# EAGLE design LCD shield C144MVGD v1 (EAGLE 6.1)
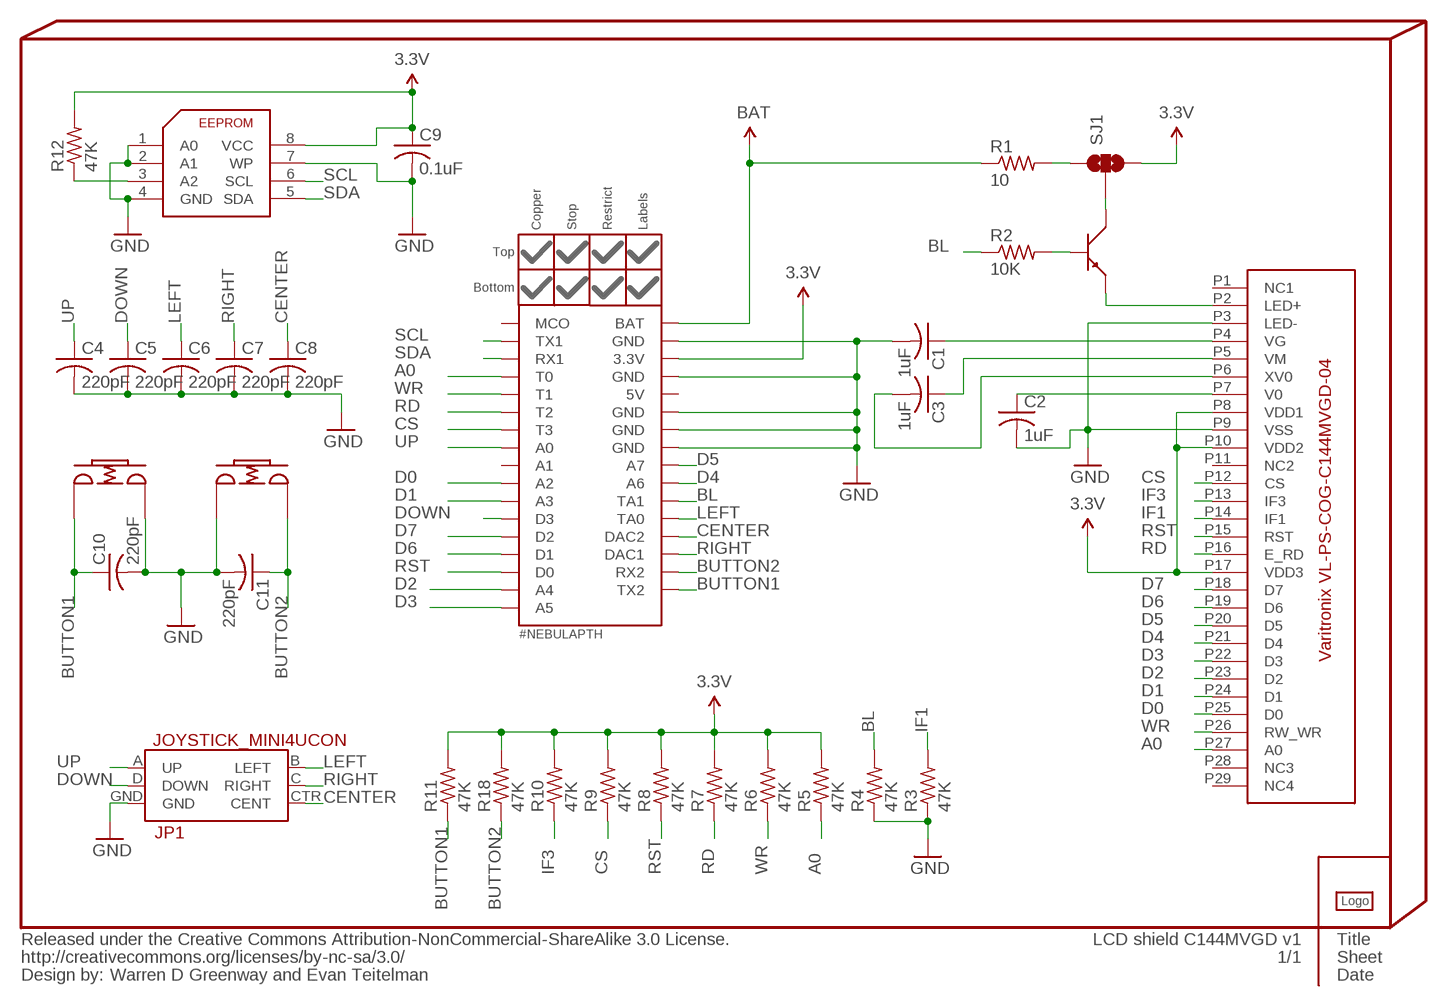
[diagram p0: schematic, sheet 1]

## Parts
C1  1uF  C-USC0402  [C0402]
C2  1uF  C-USC0402  [C0402]
C3  1uF  C-USC0402  [C0402]
C4  220pF  C-USC0402  [C0402]
C5  220pF  C-USC0402  [C0402]
C6  220pF  C-USC0402  [C0402]
C7  220pF  C-USC0402  [C0402]
C8  220pF  C-USC0402  [C0402]
C9  0.1uF  C-USC0402  [C0402]
C10  220pF  C-USC0402  [C0402]
C11  220pF  C-USC0402  [C0402]
INFO3  Warren D Greenway and Evan Teitelman  %CC-NC-SA  [%CC-NC-SA]
JP1  JOYSTICK_MINI4UCON  [JOYSTICK_MINI]
LOGO1  #PYGMYLOGOLARGE  [#PYGMYLOGO]
NEBULA1  #NEBULAPTH  [#NEBULA-PTH]
R1  10  R-US_R0805  [R0805]
R2  10K  R-US_R0402  [R0402]
R3  47K  R-US_R0402  [R0402]
R4  47K  R-US_R0402  [R0402]
R5  47K  R-US_R0402  [R0402]
R6  47K  R-US_R0402  [R0402]
R7  47K  R-US_R0402  [R0402]
R8  47K  R-US_R0402  [R0402]
R9  47K  R-US_R0402  [R0402]
R10  47K  R-US_R0402  [R0402]
R11  47K  R-US_R0402  [R0402]
R12  47K  R-US_R0402  [R0402]
R18  47K  R-US_R0402  [R0402]
SJ1  SOLDERJUMPER_2WAYPASTE1&2  [SJ_3_PASTE1&2]
U1  VARITRONIX_VL-PS-COG-C144MVGD-04FOLDED  [VARITRONIX_C144MVGD_FOLDED]
U2  BIPOLAR-PMBT6428  [DUBLIB_SOT23]
U3  EEPROM-ATMEL-AT24HC02B  [TSSOP8]
U4  SWITCH-ALPS-SKRG  [SWITCH-2P-5MM]
U5  SWITCH-ALPS-SKRG  [SWITCH-2P-5MM]

## Nets
3.3V: C9.1 NEBULA1.3.3V R5.2 R6.2 R7.2 R8.2 R9.2 R10.2 R11.2 R12.2 R18.2 SJ1.3 U1.P8(VDD1) U1.P10(VDD2) U1.P17(VDD3) U3.8(VCC) ; supply symbol labelled @3.3V
A0: NEBULA1.T0 R5.1 U1.P27(A0)
BAT: NEBULA1.BAT R1.1 ; supply symbol labelled @BAT
BL: NEBULA1.TA1 R2.1 R4.2
BUTTON1: C10.1 NEBULA1.COM2_TX(TX2) R11.1 U4.P1
BUTTON2: C11.1 NEBULA1.COM2_RX(RX2) R18.1 U5.P2
CENTER: C8.1 JP1.CTR(CENT) NEBULA1.DAC2
CS: NEBULA1.T3 R9.1 U1.P12(CS)
D0: NEBULA1.A2 U1.P25(D0)
D1: NEBULA1.A3 U1.P24(D1)
D2: NEBULA1.A4 U1.P23(D2)
D3: NEBULA1.A5 U1.P22(D3)
D4: NEBULA1.A6 U1.P21(D4)
D5: NEBULA1.A7 U1.P20(D5)
D6: NEBULA1.D1 U1.P19(D6)
D7: NEBULA1.D2 U1.P18(D7)
DOWN: C5.1 JP1.D(DOWN) NEBULA1.D3
GND: C1.2 C2.2 C4.2 C5.2 C6.2 C7.2 C8.2 C9.2 C10.2 C11.2 JP1.GND NEBULA1.GND1(GND) NEBULA1.GND2(GND) NEBULA1.GND3(GND) NEBULA1.GND4(GND) NEBULA1.GND5(GND) R3.1 R4.1 U1.P3(LED-) U1.P9(VSS) U3.1(A0) U3.2(A1) U3.4(GND) U3.7(WP) U4.P2 U5.P1 ; supply symbol labelled @GND
IF1: R3.2 U1.P14(IF1)
IF3: R10.1 U1.P13(IF3)
LEFT: C6.1 JP1.B(LEFT) NEBULA1.TA0
N$1: C1.1 U1.P4(VG)
N$2: C3.1 U1.P5(VM)
N$3: C3.2 U1.P6(XV0)
N$4: C2.1 U1.P7(V0)
N$5: SJ1.2 U2.3
N$6: U1.P2(LED+) U2.2
N$7: R2.2 U2.1
N$9: R1.2 SJ1.1
N$11: R12.1 U3.3(A2)
RD: NEBULA1.T2 R7.1 U1.P16(E_RD)
RIGHT: C7.1 JP1.C(RIGHT) NEBULA1.DAC1
RST: NEBULA1.D0 R8.1 U1.P15(RST)
SCL: NEBULA1.COM1_TX(TX1) U3.6(SCL)
SDA: NEBULA1.COM1_RX(RX1) U3.5(SDA)
UP: C4.1 JP1.A(UP) NEBULA1.A0
WR: NEBULA1.T1 R6.1 U1.P26(RW_WR)
Unconnected: NEBULA1.5V NEBULA1.A1 NEBULA1.MCO U1.P1(NC1) U1.P11(NC2) U1.P28(NC3) U1.P29(NC4)

## Library data of the parts
C1-C11 = rcl:C-US: CAPACITOR, American symbol
INFO3 = PygmyBoards:%CC-NC-SA: Released under the Creative Commons Attribution-NonCommercial-ShareAlike 3.0 License. http://creativecommons.org/licenses/by-sa/3.0 Design by: [Designer Name] Change this part's value to change the designer name
JP1 = SparkFun:JOYSTICK_MINI
LOGO1 = Pygmy:#PYGMYLOGO
NEBULA1 = PygmyBoards:#NEBULA: Nebula Board and Shield Footprint Pads This is the only absolutely required part for the footprint. The parts in "#NEBULA-PART" are merely aesthetic. A circular board outline should be .001" thick and 1.005" in diameter (Reference circle on the Document (48) layer provided).
R1-R12 R18 = rcl:R-US_: RESISTOR, American symbol
SJ1 = Pygmy:SOLDERJUMPER_2WAY: Solder Jumper 2 way solder jumper
U1 = Pygmy:VARITRONIX_VL-PS-COG-C144MVGD-04
U2 = Pygmy:BIPOLAR-PMBT6428
U3 = Pygmy:EEPROM-ATMEL-AT24HC02B
U4 U5 = Pygmy:SWITCH-ALPS-SKRG

## Board
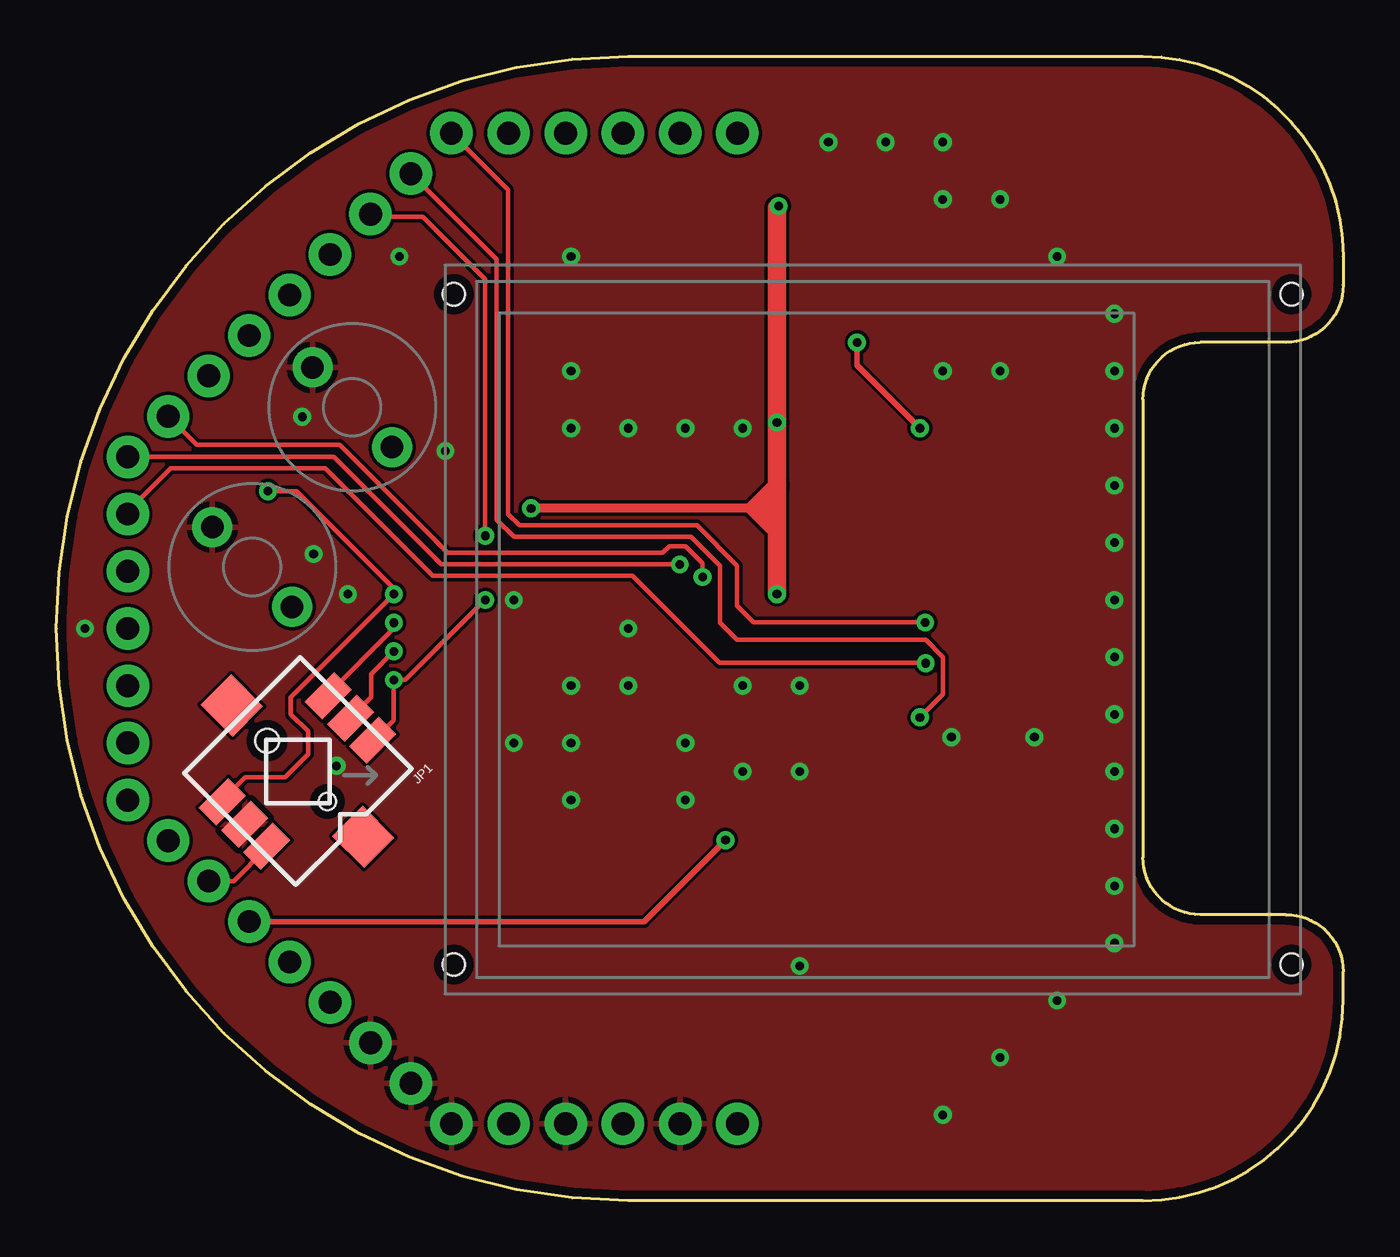
[diagram p1: board, top side]
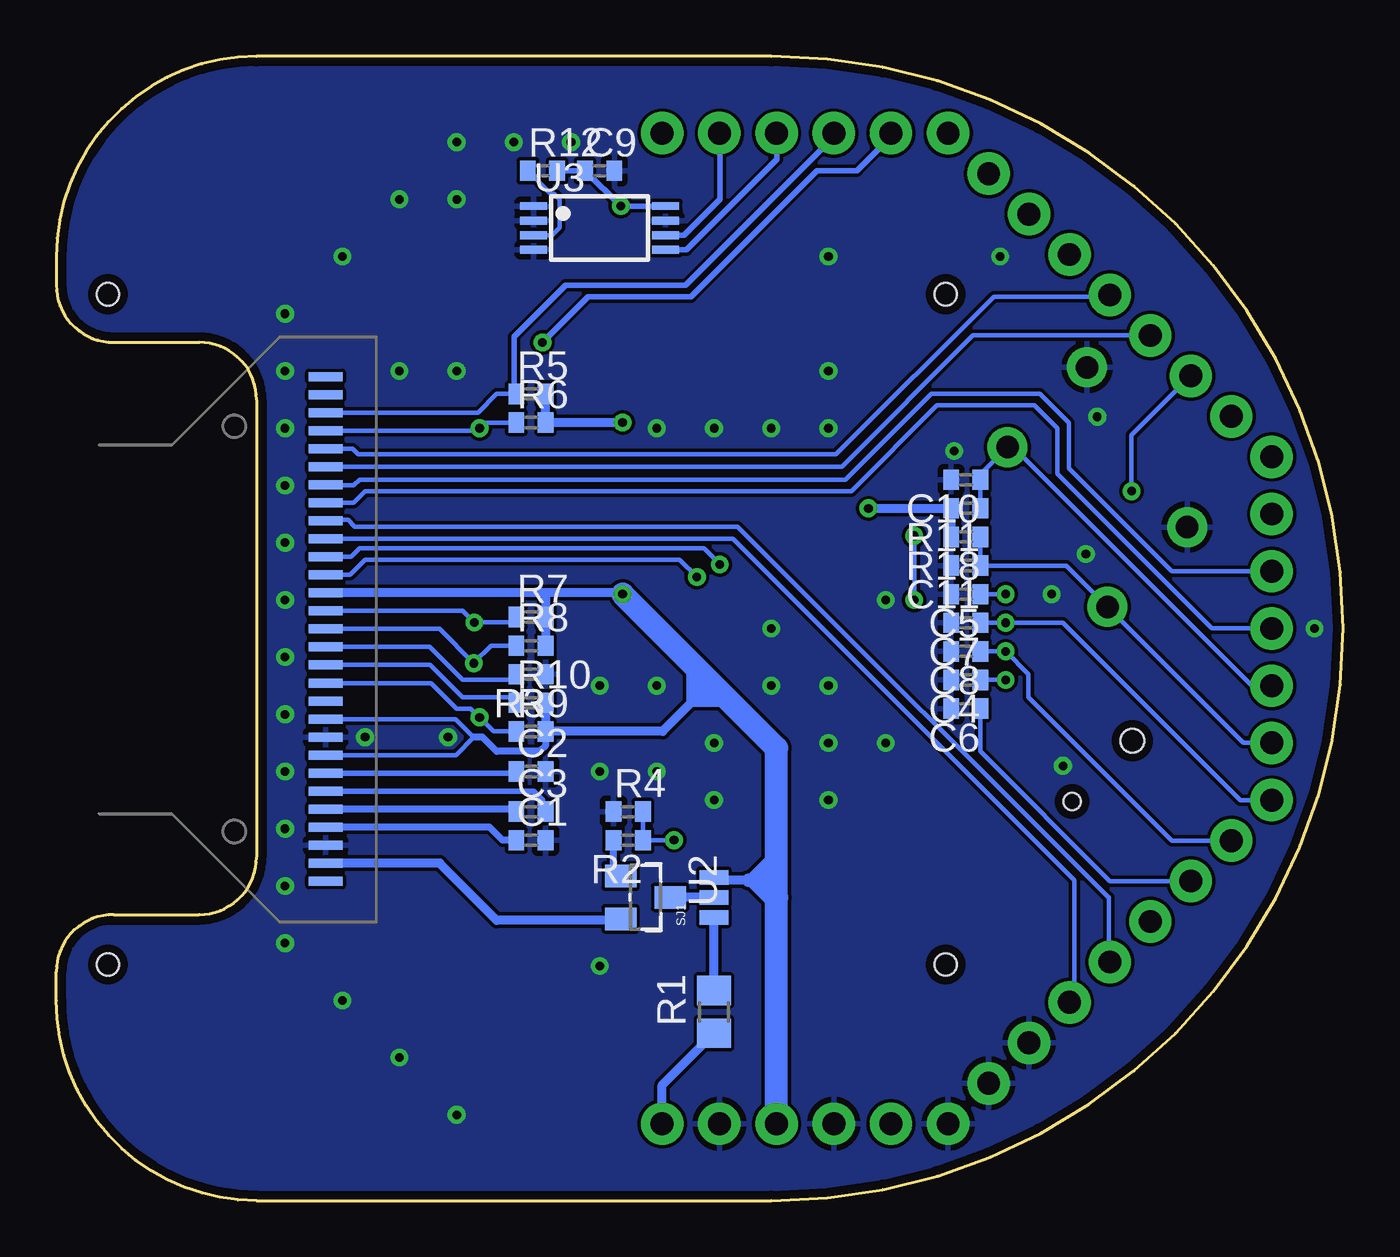
[diagram p2: board, bottom side, seen from below]

Size 57.15 x 50.8 mm. Coordinates in mm from the lower left corner, seen from the top.
Outline: 25.4,0 arc-180 25.4,50.8 48.26,50.8 arc-90 57.15,41.91 57.15,40.64 arc-90 54.61,38.1 50.8,38.1 arc90 48.26,35.56 48.26,15.24 arc90 50.8,12.7 54.61,12.7 arc-90 57.15,10.16 57.15,8.89 arc-90 48.26,0 25.4,0
Copper layers (1*16): Top 0.035mm / dielectric 1.5mm / Bottom 0.035mm
Design rules: minimum track width 6mil, minimum drill 15mil, track to track 6mil, track to pad 6mil, pad to pad 4mil, via to via 6mil, smd to smd 4mil, copper to edge 15mil, drill to drill 6mil, minimum pad ring 10mil, minimum via ring 8mil, stop-mask expansion 4mil, vias tented up to drill 25mil, thermal gap 10mil

### Footprints (pad centres in the part's own frame; a part is rotated, then mirrored left to right if it is on the bottom)
C0402 = smd 0.7 x 0.9: 1 -0.65,0; 2 0.65,0
JOYSTICK_MINI = smd 1.85 x 1.1: A 0,2.8; B 6.65,2.8; C 0,0; CTR 0,1.4; D 6.65,0; GND 6.65,1.4 | smd 1.9 x 2: NC 3.325,5.53; NC@0 3.33,-2.72 | hole 0.75: 3.34,3.295 | hole 1.05: 3.325,-0.5
#NEBULA-PTH@1 = drill 1.016 pad 1.88: 3.3V -25.637,-47.388; 5V -30.716,-47.388; A0 -36.848,-7.004; A1 -38.645,-8.8; A2 -40.44,-10.596; A3 -42.237,-12.392; A4 -47.625,-22.86; A5 -47.625,-25.4; A6 -40.44,-40.204; A7 -38.645,-42; BAT -20.557,-47.388; COM1_RX -25.636,-3.412; COM1_TX -23.096,-3.412; COM2_RX -47.625,-30.48; COM2_TX -47.625,-27.94; D0 -47.625,-20.32; D1 -47.625,-17.78; D2 -45.829,-15.984; D3 -44.032,-14.188; DAC1 -47.625,-33.02; DAC2 -45.829,-34.816; GND1 -36.848,-43.796; GND2 -35.052,-45.592; GND3 -33.256,-47.388; GND4 -28.177,-47.388; GND5 -23.097,-47.388; MCO -20.556,-3.412; T0 -28.176,-3.412; T1 -30.716,-3.412; T2 -33.256,-3.412; T3 -35.052,-5.208; TA0 -44.032,-36.612; TA1 -42.237,-38.408
R0805 = smd 1.3 x 1.5: 1 -0.95,0; 2 0.95,0
R0402 = smd 0.7 x 0.9: 1 -0.65,0; 2 0.65,0
SJ_3_PASTE1&2 = smd 0.635 x 1.27: 1 -0.889,0; 2 0,0; 3 0.889,0
VARITRONIX_C144MVGD_FOLDED = smd 0.4 x 1.5 bottom: P1 27.35,-10.06; P2 26.55,-10.06; P3 25.75,-10.06; P4 24.95,-10.06; P5 24.15,-10.06; P6 23.35,-10.06; P7 22.55,-10.06; P8 21.75,-10.06; P9 20.95,-10.06; P10 20.15,-10.06; P11 19.35,-10.06; P12 18.55,-10.06; P13 17.75,-10.06; P14 16.95,-10.06; P15 16.15,-10.06; P16 15.35,-10.06; P17 14.55,-10.06; P18 13.75,-10.06; P19 12.95,-10.06; P20 12.15,-10.06; P21 11.35,-10.06; P22 10.55,-10.06; P23 9.75,-10.06; P24 8.95,-10.06; P25 8.15,-10.06; P26 7.35,-10.06; P27 6.55,-10.06; P28 5.75,-10.06; P29 4.95,-10.06 | hole 1: 1.29,-0.39; 1.29,-37.59; 31.05,-37.59; 31.05,-0.39
DUBLIB_SOT23 = smd 1 x 1.4: 1 -0.95,-1.1; 2 0.95,-1.1; 3 0,1.1
TSSOP8 = smd 1.2 x 0.35: 1 -2.925,0.975; 2 -2.925,0.325; 3 -2.925,-0.325; 4 -2.925,-0.975; 5 2.925,-0.975; 6 2.925,-0.325; 7 2.925,0.325; 8 2.925,0.975
SWITCH-2P-5MM = drill 1 pad 1.778: P1 0,0; P2 5,0

### Placement (x,y rotation side)
C1  36.07,16 0 bottom
C2  36.07,19.05 0 bottom
C3  36.07,17.27 0 bottom
C4  16.76,23.11 180 bottom
C5  16.76,26.92 180 bottom
C6  16.76,21.84 180 bottom
C7  16.76,25.65 180 bottom
C8  16.76,24.38 180 bottom
C9  33.02,45.72 0 bottom
C10  16.76,32 180 bottom
C11  16.76,28.19 180 bottom
INFO3  -2.54,-10.16 0 top  (outside the outline)
JP1  12.07,22.41 225 top
LOGO1  49.53,44.45 0 bottom
NEBULA1  #NEBULAPTH  [#NEBULA-PTH@1]  50.8,50.8 0 top
R1  27.94,8.38 90 bottom
R2  31.75,16 180 bottom
R3  36.07,23.37 180 bottom
R4  31.75,17.27 0 bottom
R5  36.07,35.81 0 bottom
R6  36.07,34.54 0 bottom
R7  36.07,25.91 0 bottom
R8  36.07,24.64 0 bottom
R9  36.07,20.83 0 bottom
R10  36.07,22.1 0 bottom
R11  16.76,30.73 180 bottom
R12  35.56,45.72 0 bottom
R18  16.76,29.46 180 bottom
SJ1  27.94,13.46 90 bottom
U1  55.24,41.53 270 top
U2  30.99,13.46 270 bottom
U3  33.02,43.18 0 bottom
U4  14.91,33.45 135 top
U5  6.93,29.9 315 top

### Tracks (layer width: path | path; a pad name or v marks a point on that pad's centre or on a via)
3.3V  (via drill 0.38)
  Top 0.406: 31.24,30.73 32,30.73 | 30.73,30.73 31.24,30.73 | 30.73,30.73 v21.08,30.73 | 31.24,30.73 32,31.5 | 30.73,30.73 32,32 | 32,29.46 30.73,30.73 | 32,29.97 31.24,30.73
  Top 0.61: 32,44.08 v32.08,44.16
  Top 0.813: v32,26.92 32,29.46 32,29.97 32,30.73 32,31.5 32,32 v32,34.54 32,44.08
  Bottom 0.203: R8.2 R7.2 | R9.2 R10.2 | U1.P10 39.41,21.38 38.61,20.57 39.4,19.78 U1.P8 | R18.2 R11.2
  Bottom 0.254: R7.2 35.43,25.92 | U3.8 v32.08,44.16 C9.1 R12.2
  Bottom 0.305: 38.61,20.57 38.23,20.57 37.59,19.94 35.69,19.94 35.43,20.19 35.43,20.81
  Bottom 0.406: R10.2 35.43,22.08 35.43,20.81 | R18.2 17.41,30.62 17.53,30.73 v21.08,30.73 | R9.2 30.23,20.83 28.96,22.1 | 28.7,22.35 28.07,22.99 | 28.96,22.1 28.7,22.35 | 35.31,26.98 32.06,26.98 v32,26.92 | 35.31,26.98 U1.P17 | R8.2 35.42,26.87 35.31,26.98 | v32,34.54 R6.2 R5.2 | 28.7,22.35 28.7,23.62 | 27.43,22.35 28.7,22.35 | 28.96,22.1 28.96,23.88 | 27.18,22.1 28.96,22.1 | 26.42,14.22 25.15,15.49 | 26.42,14.22 25.15,12.95 | 25.15,14.99 25.91,14.22 25.15,13.46 | 26.42,14.22 27.94,14.22 SJ1.3
  Bottom 0.61: 25.16,13.46 25.91,14.22 26.42,14.22
  Bottom 1.016: NEBULA1.3.3V 25.16,13.46 25.16,20.08 27.18,22.1 27.43,22.35 28.07,22.99 28.7,23.62 28.96,23.88 v32,26.92
A0
  Bottom 0.203: U1.P27 38.43,34.98 37.59,35.81 R5.1
  Bottom 0.254: NEBULA1.T0 22.62,47.23 29.21,40.64 34.54,40.64 36.83,38.35 36.83,35.93 R5.1
BAT
  Bottom 0.406: NEBULA1.BAT 30.24,5.13 R1.1
BL  (via drill 0.38)
  Top 0.254: NEBULA1.TA1 26.11,12.39 v29.72,16
  Bottom 0.203: v29.72,16 R2.1 R4.2
BUTTON1
  Bottom 0.203: NEBULA1.COM2_TX 4.06,22.86 14.73,33.53 14.84,33.53 U4.P1 16.11,32.25 C10.1 R11.1
BUTTON2
  Bottom 0.203: U5.P2 10.41,26.42 | R18.1 C11.1 12.3,28.19 U5.P2 | NEBULA1.COM2_RX 4.43,20.32 U5.P2
CENTER  (via drill 0.38)
  Top 0.203: JP1.CTR 13.06,21.44 13.97,22.35 13.97,23.37 v14.99,24.38
  Bottom 0.203: C8.1 v14.99,24.38 13.97,23.37 13.97,22.35 7.6,15.98 NEBULA1.DAC2
CS  (via drill 0.38)
  Top 0.203: v38.35,21.46 39.37,22.47 39.37,24.13 38.61,24.89 30.23,24.89 29.46,25.65 29.46,28.19 28.19,29.46 20.32,29.46 19.56,30.23 19.56,41.78 NEBULA1.T3
  Bottom 0.203: R9.1 37.73,20.83 v38.35,21.46 38.74,21.84 39.37,21.84 40.51,22.98 U1.P12
D0
  Bottom 0.203: NEBULA1.A2 10.43,40.13 15.51,40.13 22.52,33.12 43.74,33.12 44,33.38 U1.P25
D1
  Bottom 0.203: U1.P24 22.27,32.58 16.44,38.41 NEBULA1.A3
D2
  Bottom 0.203: U1.P23 45.16,31.75 43.94,31.75 43.69,32 22.1,32 18.29,35.81 13.46,35.81 12.19,34.54 12.19,32.51 7.62,27.94 NEBULA1.A4
D3
  Bottom 0.203: NEBULA1.A5 5.84,25.4 12.7,32.26 12.7,34.29 13.72,35.31 18.03,35.31 21.84,31.5 43.43,31.5 43.94,30.99 U1.P22
D4
  Bottom 0.203: NEBULA1.A6 10.41,10.65 10.41,13.46 10.43,13.46 26.89,29.93 43.9,29.93 44.2,30.23 45.14,30.23 U1.P21
D5
  Bottom 0.203: U1.P20 27.09,29.38 11.94,14.22 11.94,9.02 NEBULA1.A7
D6  (via drill 0.38)
  Top 0.203: NEBULA1.D1 12.32,33.02 17.09,28.25 v27.69,28.25
  Bottom 0.203: U1.P19 44.06,28.58 43.69,28.96 28.4,28.96 v27.69,28.25
D7  (via drill 0.38)
  Top 0.203: v28.7,27.69 28.7,28.3 27.94,29.06 27.23,29.06 26.92,28.75 17.38,28.75 12.59,33.55 6.24,33.55 NEBULA1.D2 5.06,34.82
  Bottom 0.203: U1.P18 44.1,27.78 43.43,28.45 29.46,28.45 v28.7,27.69
DOWN  (via drill 0.38)
  Top 0.203: JP1.D 7.37,17.78 8.38,18.8 10.16,18.8 11.18,19.81 11.18,20.83 10.41,21.59 10.41,22.35 v14.99,26.92 14.99,27.18 10.67,31.5 v9.4,31.5
  Bottom 0.203: v14.99,26.92 C5.1 | v9.4,31.5 9.4,33.98 NEBULA1.D3
GND  (via drill 0.38)
  other vias: 46.99,24.13 33.02,22.86 39.75,20.57 30.48,34.29 22.86,34.29 27.94,34.29 46.99,11.43 22.86,22.86 27.94,17.78 39.37,3.81 41.91,6.35 20.32,20.32 12.95,26.92 46.99,13.97 22.86,41.91 34.29,46.99 36.83,46.99 22.86,17.78 41.91,36.83 39.37,46.99 41.91,44.45 44.45,41.91 46.99,39.37 46.99,34.29 46.99,31.75 46.99,29.21 46.99,36.83 46.99,26.67 46.99,21.59 43.43,20.57 46.99,19.05 46.99,16.51 12.45,19.3 33.02,19.05 44.45,8.89 11.43,28.7 33.02,10.41 22.86,20.32 30.48,22.86 25.4,22.86 30.48,19.05 15.24,41.91 17.27,33.27 39.37,44.45 22.86,36.83 25.4,34.29 25.4,25.4 10.92,34.8 27.94,20.32 1.27,25.4 39.37,36.83 20.32,26.67
  pour Bottom: -2.54,53.34 59.69,53.34 59.69,-2.54 -2.54,-2.54
  pour Top: -1.27,52.07 58.42,52.07 58.42,-1.27 -1.27,-1.27
IF1
  Bottom 0.203: U1.P14 40.58,24.58 39.12,23.11 36.97,23.11 R3.2
IF3
  Bottom 0.203: U1.P13 40.54,23.78 39.12,22.35 36.97,22.35 R10.1
LEFT
  Top 0.203: JP1.B 9.35,15.66 7.87,14.19 NEBULA1.TA0
  Bottom 0.203: C6.1 16.11,19.94 10.36,14.19 NEBULA1.TA0
N$1
  Bottom 0.305: U1.P4 37.91,16.58 37.34,16 C1.1
N$2
  Bottom 0.305: U1.P5 36.72,17.38 C3.1
N$3
  Bottom 0.254: U1.P6 35.96,18.18 35.56,17.78 35.56,17.41 C3.2
N$4
  Bottom 0.254: U1.P7 36.79,18.98 C2.1
N$5
  Bottom 0.406: SJ1.2 U2.3
N$6
  Bottom 0.406: U1.P2 40.12,14.98 37.59,12.45 32.15,12.45 U2.2
N$7
  Bottom 0.203: 32.4,14.47 32.15,14.47 U2.1
  Bottom 0.305: 32.4,14.47 R2.2
N$9
  Bottom 0.406: R1.2 SJ1.1
N$11
  Bottom 0.203: U3.3 35.12,42.86 34.8,43.18 34.8,44.45 35.05,44.7 35.19,44.7 R12.1
RD  (via drill 0.38)
  Top 0.203: v38.59,25.67 30.97,25.67 30.23,26.42 30.23,28.19 28.45,29.97 20.57,29.97 20.07,30.48 20.07,44.87 NEBULA1.T2
  Bottom 0.203: U1.P16 39.1,26.18 v38.59,25.67 36.95,25.67 R7.1
RIGHT  (via drill 0.38)
  Top 0.203: JP1.C 12.07,22.48 14.99,25.4 v14.99,25.65
  Bottom 0.203: NEBULA1.DAC1 4.57,17.78 12.45,25.65 v14.99,25.65 C7.1
RST  (via drill 0.38)
  Top 0.203: v38.61,23.86 38.61,23.88 29.44,23.88 25.58,27.74 16.71,27.74 11.94,32.51 5.08,32.51 3.18,30.61 NEBULA1.D0
  Bottom 0.203: U1.P15 40.13,25.38 v38.61,23.86 38.61,23.88 37.85,24.64 R8.1
SCL
  Bottom 0.254: U3.6 29.28,42.86 27.69,44.45 27.69,47.37 NEBULA1.COM1_TX
SDA
  Bottom 0.254: U3.5 29.17,42.2 25.15,46.23 25.15,47.37 NEBULA1.COM1_RX
UP  (via drill 0.38)
  Top 0.203: v19.05,29.52 19.05,40.89 16.26,43.69 14.06,43.69 NEBULA1.A0 | JP1.A 14.08,20.43 14.99,21.34 v14.99,23.11 15.49,23.11 v19.05,26.67
  Bottom 0.203: v14.99,23.11 C4.1 | v19.05,26.67 v19.05,29.52
WR  (via drill 0.38)
  Top 0.254: v35.56,38.1 35.56,37.08 v38.35,34.29
  Bottom 0.203: U1.P26 38.47,34.18 v38.35,34.29 | 38.23,34.42 38.1,34.54 R6.1
  Bottom 0.254: NEBULA1.T1 20.08,47.23 21.59,45.72 23.37,45.72 28.96,40.13 33.53,40.13 v35.56,38.1 | v38.35,34.29 38.23,34.42

### Text on the board
bTest: Pygmy Nebula | LCD Shield V1 Rev2 | Design By: | Warren D Greenway | Evan Teitelman
Document: Pygmy LCD Shield | Version 1.1 | Standard Grid: 50mil | Routing Grids: 8mil / 4mil